# Altium schematic sheet transistor_tester_V1.07_E3.SchDoc
size A2
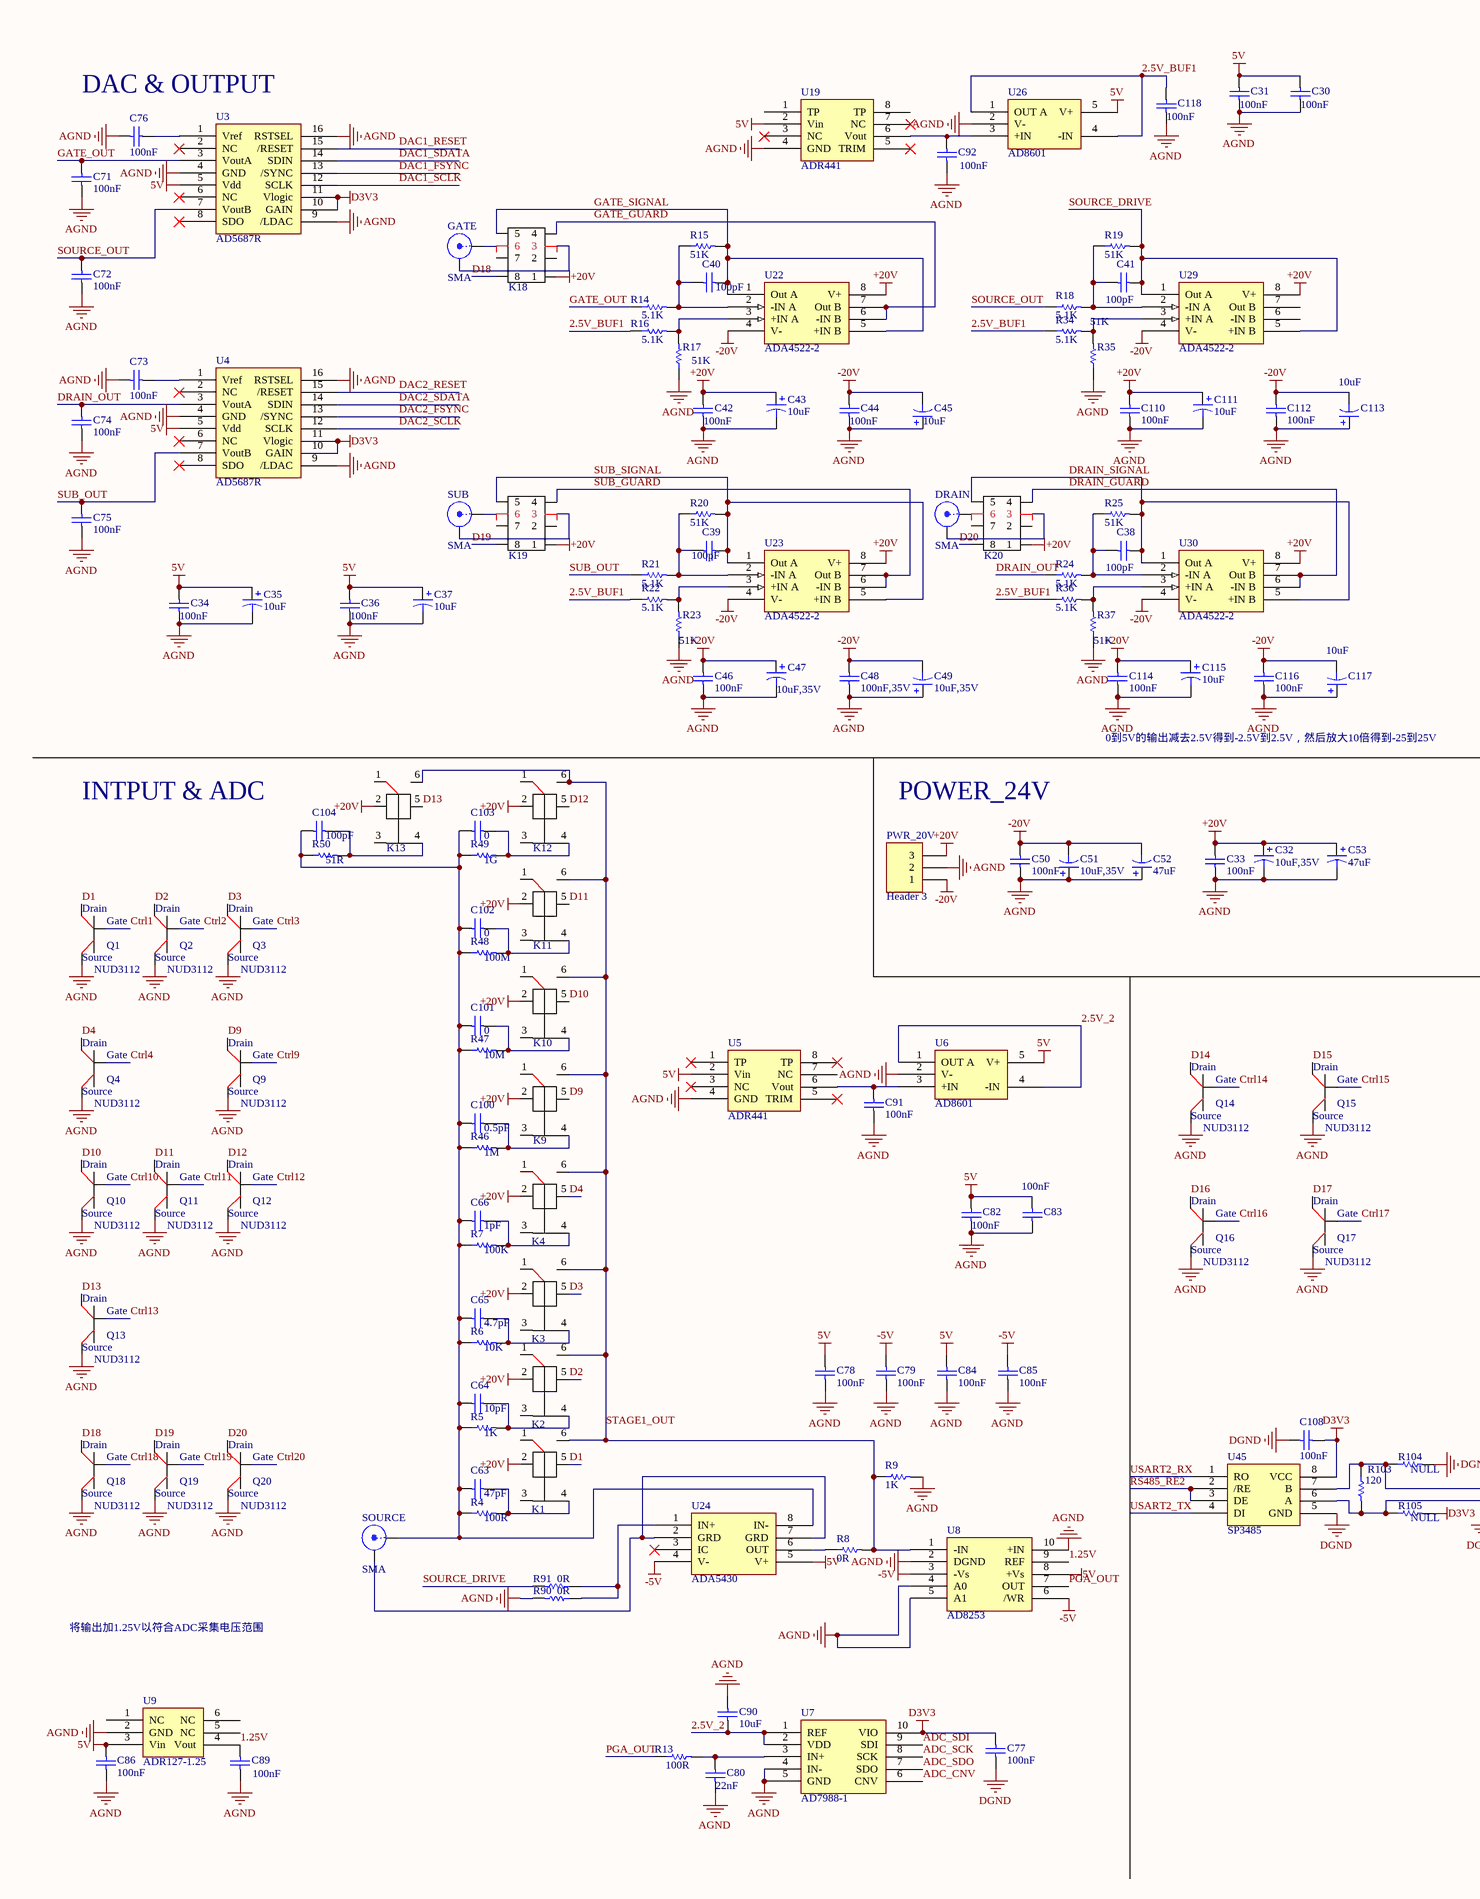
[diagram p0: transistor_tester_V1.07_E3.SchDoc, left]
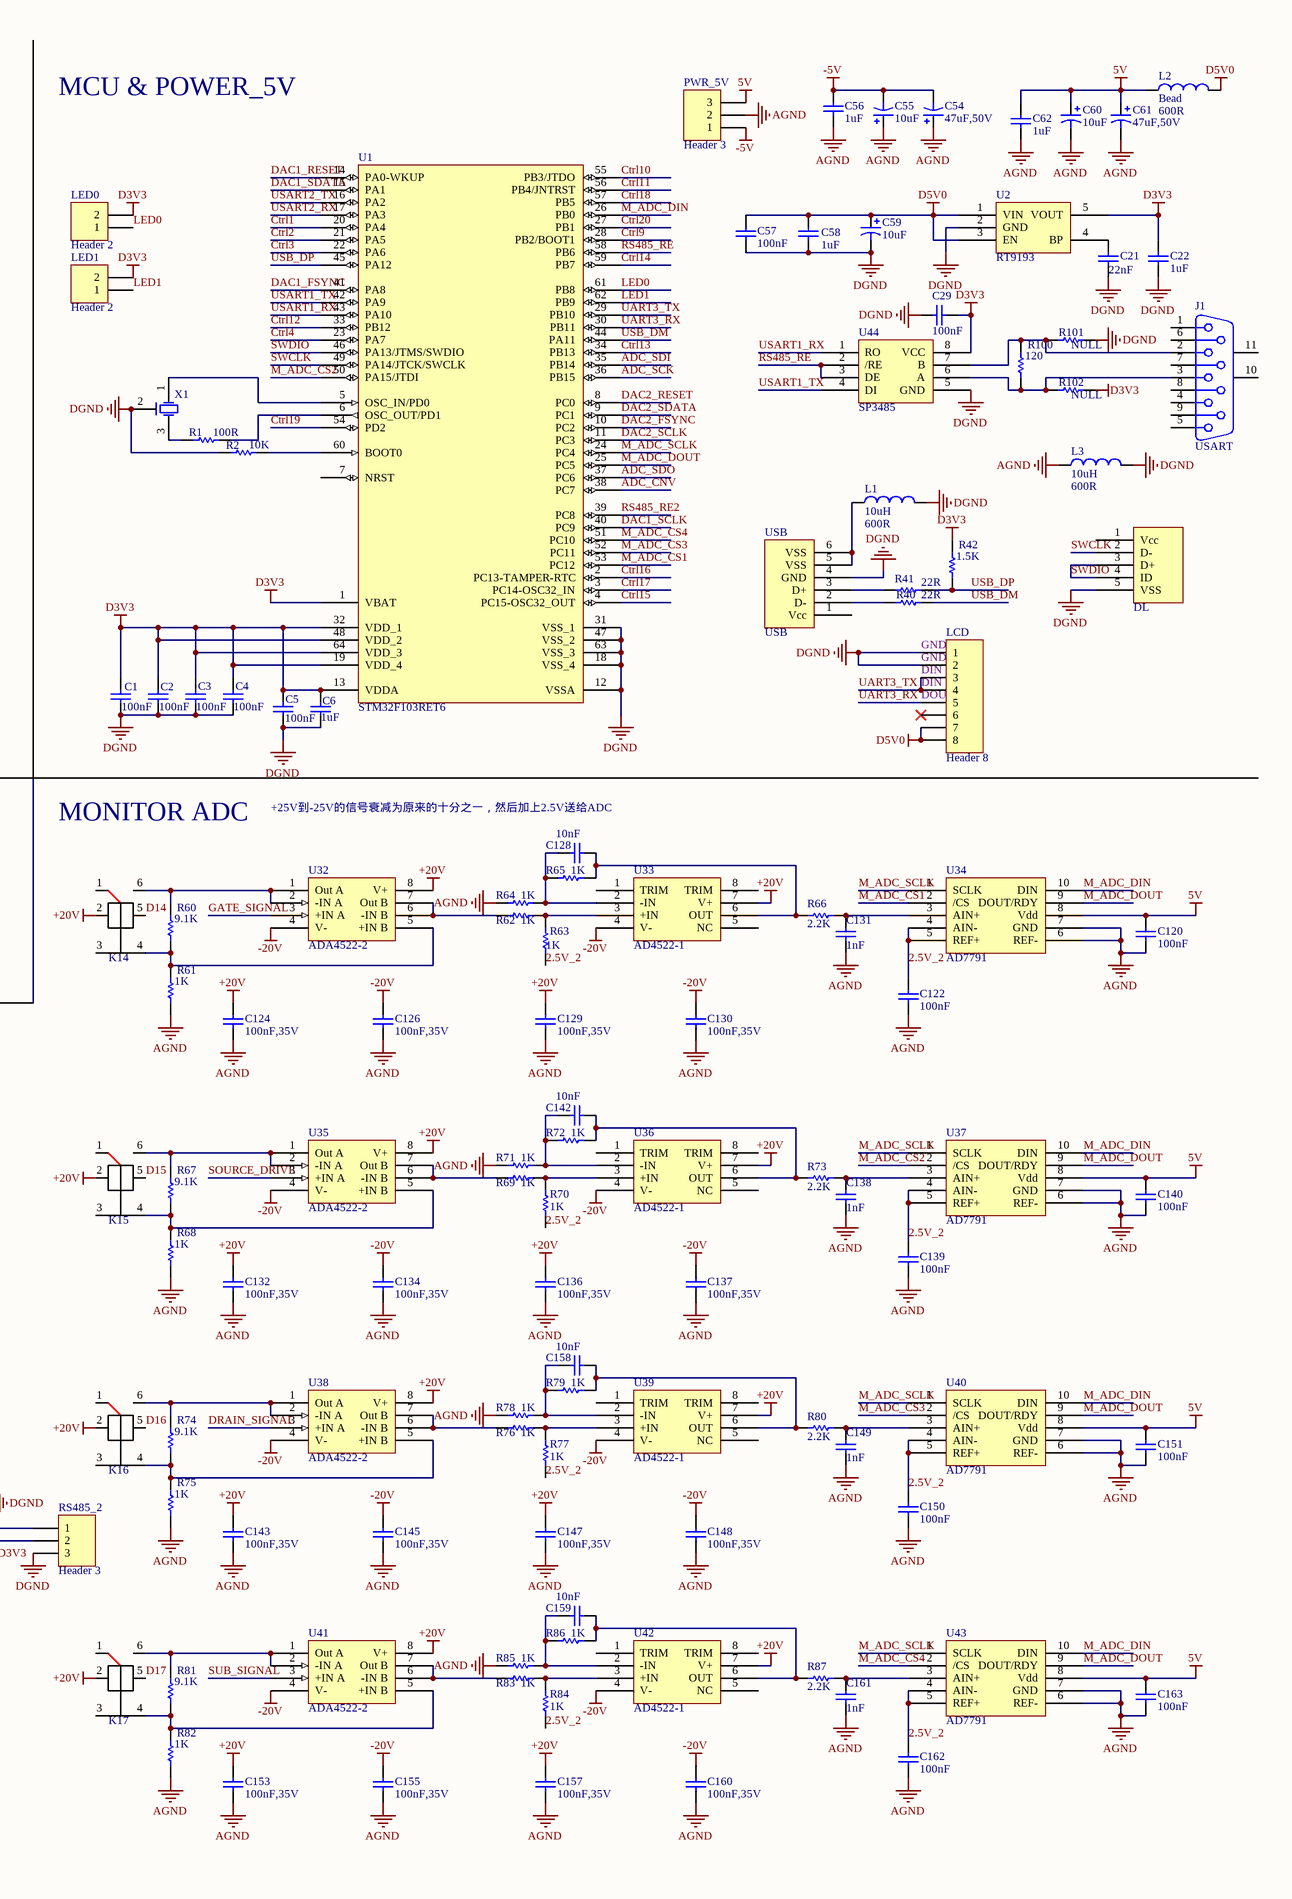
[diagram p1: transistor_tester_V1.07_E3.SchDoc, right]

## Parts
C1  100nF  [0603]
C2  100nF  [0603]
C3  100nF  [0603]
C4  100nF  [0603]
C5  100nF  [0603]
C6  1uF  [0603]
C21  22nF  [0603]
C22  1uF  [0603]
C29  100nF  [0603]
C30  100nF  [0805]
C31  100nF  [0805]
C32  value 10uF,35V  [6032_pol]  (hidden comment: 10uF)
C33  100nF  [0805]
C34  100nF  [0805]
C35  10uF  [6032_pol]
C36  100nF  [0805]
C37  10uF  [6032_pol]
C38  100pF  [0805]
C39  100pF  [0805]
C40  100pF  [0805]
C41  100pF  [0805]
C42  100nF  [0805]
C43  10uF  [6032_pol]
C44  100nF  [0805]
C45  10uF  [6032_pol]
C46  100nF  [0805]
C47  value 10uF,35V  [6032_pol]  (hidden comment: 10uF)
C48  value 100nF,35V  [0805]  (hidden comment: 100nF)
C49  value 10uF,35V  [6032_pol]  (hidden comment: 10uF)
C50  100nF  [0805]
C51  value 10uF,35V  [6032_pol]  (hidden comment: 10uF)
C52  47uF  [cap_pol_8*10.2]
C53  47uF  [cap_pol_8*10.2]
C54  47uF,50V  [cap_pol_8*10.2]
C55  10uF  [6032_pol]
C56  1uF  [0805]
C57  100nF  [0805]
C58  1uF  [0805]
C59  10uF  [6032_pol]
C60  10uF  [6032_pol]
C61  47uF,50V  [cap_pol_8*10.2]
C62  1uF  [0805]
C63  47pF  [0805]
C64  10pF  [0805]
C65  value 4.7pF  [0805]  (hidden comment: 5pF)
C66  1pF  [0805]
C71  100nF  [0603]
C72  100nF  [0603]
C73  100nF  [0603]
C74  100nF  [0603]
C75  100nF  [0603]
C76  100nF  [0603]
C77  100nF  [0805]
C78  100nF  [0603]
C79  100nF  [0603]
C80  22nF  [0603]
C82  100nF  [0603]
C83  100nF  [0805]
C84  100nF  [0805]
C85  100nF  [0805]
C86  100nF  [0603]
C89  100nF  [0603]
C90  10uF  [0805]
C91  100nF  [0805]
C92  100nF  [0805]
C100  0.5pF  [0805]
C101  value 0  [0805]  (hidden comment: NULL)
C102  value 0  [0805]  (hidden comment: NULL)
C103  value 0  [0805]  (hidden comment: NULL)
C104  100pF  [0805]
C108  100nF  [0603]
C110  100nF  [0805]
C111  10uF  [6032_pol]
C112  100nF  [0805]
C113  10uF  [6032_pol]
C114  100nF  [0805]
C115  10uF  [6032_pol]
C116  100nF  [0805]
C117  10uF  [6032_pol]
C118  100nF  [0805]
C120  100nF  [0805]
C122  100nF  [0805]
C124  value 100nF,35V  [0805]  (hidden comment: 100nF)
C126  value 100nF,35V  [0805]  (hidden comment: 100nF)
C128  10nF  [0603]
C129  value 100nF,35V  [0805]  (hidden comment: 100nF)
C130  value 100nF,35V  [0805]  (hidden comment: 100nF)
C131  1nF  [0603]
C132  value 100nF,35V  [0805]  (hidden comment: 100nF)
C134  value 100nF,35V  [0805]  (hidden comment: 100nF)
C136  value 100nF,35V  [0805]  (hidden comment: 100nF)
C137  value 100nF,35V  [0805]  (hidden comment: 100nF)
C138  1nF  [0603]
C139  100nF  [0805]
C140  100nF  [0805]
C142  10nF  [0603]
C143  value 100nF,35V  [0805]  (hidden comment: 100nF)
C145  value 100nF,35V  [0805]  (hidden comment: 100nF)
C147  value 100nF,35V  [0805]  (hidden comment: 100nF)
C148  value 100nF,35V  [0805]  (hidden comment: 100nF)
C149  1nF  [0603]
C150  100nF  [0805]
C151  100nF  [0805]
C153  value 100nF,35V  [0805]  (hidden comment: 100nF)
C155  value 100nF,35V  [0805]  (hidden comment: 100nF)
C157  value 100nF,35V  [0805]  (hidden comment: 100nF)
C158  10nF  [0603]
C159  10nF  [0603]
C160  value 100nF,35V  [0805]  (hidden comment: 100nF)
C161  1nF  [0603]
C162  100nF  [0805]
C163  100nF  [0805]
DL  USB_5pin  [USBmicro_B]  (value not drawn)
DRAIN  SMA  [SMA]
GATE  SMA  [SMA]
J1  USART  [DSUB1.385-2H9]
K1  Relay  [Relay_OMRON5V]  (value not drawn)
K2  Relay  [Relay_OMRON5V]  (value not drawn)
K3  Relay  [Relay_OMRON5V]  (value not drawn)
K4  Relay  [Relay_OMRON5V]  (value not drawn)
K9  Relay  [Relay_OMRON5V]  (value not drawn)
K10  Relay  [Relay_OMRON5V]  (value not drawn)
K11  Relay  [Relay_OMRON5V]  (value not drawn)
K12  Relay  [Relay_OMRON5V]  (value not drawn)
K13  Relay  [Relay_OMRON5V]  (value not drawn)
K14  Relay  [Relay_OMRON5V]  (value not drawn)
K15  Relay  [Relay_OMRON5V]  (value not drawn)
K16  Relay  [Relay_OMRON5V]  (value not drawn)
K17  Relay  [Relay_OMRON5V]  (value not drawn)
K18  AXICOM IM  [AXICOM_IM06]  (value not drawn)
K19  AXICOM IM  [AXICOM_IM06]  (value not drawn)
K20  AXICOM IM  [AXICOM_IM06]  (value not drawn)
L1  10uH  value 600R  [0805]
L2  Bead  value 600R  [8040]
L3  10uH  value 600R  [1206]
LCD  Header 8  [HDR1X8]
LED0  Header 2  [HDR1X2]
LED1  Header 2  [HDR1X2]
PWR_5V  Header 3  [PWR_3T]
PWR_20V  Header 3  [PWR_3T]
Q1  NUD3112  [SOT-23]
Q2  NUD3112  [SOT-23]
Q3  NUD3112  [SOT-23]
Q4  NUD3112  [SOT-23]
Q9  NUD3112  [SOT-23]
Q10  NUD3112  [SOT-23]
Q11  NUD3112  [SOT-23]
Q12  NUD3112  [SOT-23]
Q13  NUD3112  [SOT-23]
Q14  NUD3112  [SOT-23]
Q15  NUD3112  [SOT-23]
Q16  NUD3112  [SOT-23]
Q17  NUD3112  [SOT-23]
Q18  NUD3112  [SOT-23]
Q19  NUD3112  [SOT-23]
Q20  NUD3112  [SOT-23]
R1  100R  [0603]
R2  10K  [0603]
R4  value 100R  [0805]  (hidden comment: 100R_R)
R5  value 1K  [0805]  (hidden comment: 1K_R)
R6  value 10K  [0805]  (hidden comment: 10K_R)
R7  100K  [0805]
R8  0R  [0603]
R9  1K  [0603]
R13  100R  [0603]
R14  5.1K  [0805]
R15  51K  [0805]
R16  5.1K  [0805]
R17  51K  [0805]
R18  5.1K  [0805]
R19  51K  [0805]
R20  51K  [0805]
R21  5.1K  [0805]
R22  5.1K  [0805]
R23  51K  [0805]
R24  5.1K  [0805]
R25  51K  [0805]
R34  5.1K  [0805]
R35  51K  [0805]
R36  5.1K  [0805]
R37  51K  [0805]
R40  22R  [0402]
R41  22R  [0402]
R42  1.5K  [0402]
R46  1M  [0805]
R47  value 10M  [0805]  (hidden comment: 10M_R)
R48  value 100M  [0805]  (hidden comment: 100M_R)
R49  value 1G  [0805]  (hidden comment: 1G_R)
R50  value 51R  [0805]  (hidden comment: 51R_R)
R60  9.1K  [0603]
R61  1K  [0603]
R62  1K  [0603]
R63  1K  [0603]
R64  1K  [0603]
R65  1K  [0603]
R66  2.2K  [0603]
R67  9.1K  [0603]
R68  1K  [0603]
R69  1K  [0603]
R70  1K  [0603]
R71  1K  [0603]
R72  1K  [0603]
R73  2.2K  [0603]
R74  9.1K  [0603]
R75  1K  [0603]
R76  1K  [0603]
R77  1K  [0603]
R78  1K  [0603]
R79  1K  [0603]
R80  2.2K  [0603]
R81  9.1K  [0603]
R82  1K  [0603]
R83  1K  [0603]
R84  1K  [0603]
R85  1K  [0603]
R86  1K  [0603]
R87  2.2K  [0603]
R90  0R  [0603]
R91  value 0R  [0603]  (hidden comment: Res1)
R100  120  [0603]
R101  NULL  [0603]
R102  NULL  [0603]
R103  120  [0603]
R104  NULL  [0603]
R105  NULL  [0603]
RS485_2  Header 3  [HDR1X3]
SOURCE  SMA  [SMA]
SUB  SMA  [SMA]
U1  STM32F103RET6  [LQFP64_N]
U2  RT9193  [SOT-23-5]
U3  AD5687R  [TSSOP16]
U4  AD5687R  [TSSOP16]
U5  ADR441  [SO-8N]
U6  AD8601  [SOT-23-5]
U7  AD7988-1  [MSOP10]
U8  AD8253  [RM-10]
U9  ADR127-1.25  [SOT_UJ6]
U19  ADR441  [SO-8N]
U22  ADA4522-2  [SO-8N]
U23  ADA4522-2  [SO-8N]
U24  ADA5430  [SO-8N]
U26  AD8601  [SOT-23-5]
U29  ADA4522-2  [SO-8N]
U30  ADA4522-2  [SO-8N]
U32  ADA4522-2  [SO-8N]
U33  AD4522-1  [SO-8N]
U34  AD7791  [RM-10]
U35  ADA4522-2  [SO-8N]
U36  AD4522-1  [SO-8N]
U37  AD7791  [RM-10]
U38  ADA4522-2  [SO-8N]
U39  AD4522-1  [SO-8N]
U40  AD7791  [RM-10]
U41  ADA4522-2  [SO-8N]
U42  AD4522-1  [SO-8N]
U43  AD7791  [RM-10]
U44  SP3485  [SO-8N]
U45  SP3485  [SO-8N]
USB  USB  [USB_A]
X1  8M smd  [8Mhz_XTAL]  (value not drawn)

## Nets
5V: C30.2 C31.2 C34.2 C35.1 C36.2 C37.1 C60.1 C61.1 C62.2 C78.2 C82.2 C83.2 C84.2 C86.2 C120.2 C140.2 C151.2 C163.2 L2.1 PWR_5V.3 U3.5(Vdd) U4.5(Vdd) U5.2(Vin) U6.5(V+) U8.8(+Vs) U9.3(Vin) U19.2(Vin) U24.5(V+) U26.5(V+) U34.8(Vdd) U37.8(Vdd) U40.8(Vdd) U43.8(Vdd)
+20V: C32.1 C33.1 C42.2 C43.1 C46.2 C47.1 C53.1 C110.2 C111.1 C114.2 C115.1 C124.2 C129.2 C132.2 C136.2 C143.2 C147.2 C153.2 C157.2 K1.2 K2.2 K3.2 K4.2 K9.2 K10.2 K11.2 K12.2 K13.2 K14.2 K15.2 K16.2 K17.2 K18.1 K19.1 K20.1 PWR_20V.3 U22.8(V+) U23.8(V+) U29.8(V+) U30.8(V+) U32.8(V+) U33.7(V+) U35.8(V+) U36.7(V+) U38.8(V+) U39.7(V+) U41.8(V+) U42.7(V+)
-5V: C54.2 C55.2 C56.2 C79.2 C85.2 PWR_5V.1 U8.3(-Vs) U8.6(/WR) U24.4(V-)
-20V: C44.2 C45.2 C48.2 C49.2 C50.1 C51.2 C52.2 C112.2 C113.2 C116.2 C117.2 C126.2 C130.2 C134.2 C137.2 C145.2 C148.2 C155.2 C160.2 PWR_20V.1 U22.4(V-) U23.4(V-) U29.4(V-) U30.4(V-) U32.4(V-) U33.4(V-) U35.4(V-) U36.4(V-) U38.4(V-) U39.4(V-) U41.4(V-) U42.4(V-)
AGND: C30.1 C31.1 C32.2 C33.2 C34.1 C35.2 C36.1 C37.2 C42.1 C43.2 C44.1 C45.1 C46.1 C47.2 C48.1 C49.1 C50.2 C51.1 C52.1 C53.2 C54.1 C55.1 C56.1 C60.2 C61.2 C62.1 C71.2 C72.2 C73.2 C74.2 C75.2 C76.2 C78.1 C79.1 C80.2 C82.1 C83.1 C84.1 C85.1 C86.1 C89.1 C90.2 C91.1 C92.1 C110.1 C111.2 C112.1 C113.1 C114.1 C115.2 C116.1 C117.1 C118.1 C120.1 C122.1 C124.1 C126.1 C129.1 C130.1 C131.1 C132.1 C134.1 C136.1 C137.1 C138.1 C139.1 C140.1 C143.1 C145.1 C147.1 C148.1 C149.1 C150.1 C151.1 C153.1 C155.1 C157.1 C160.1 C161.1 C162.1 C163.1 L3.1 PWR_5V.2 PWR_20V.2 Q1.2(Source) Q2.2(Source) Q3.2(Source) Q4.2(Source) Q9.2(Source) Q10.2(Source) Q11.2(Source) Q12.2(Source) Q13.2(Source) Q14.2(Source) Q15.2(Source) Q16.2(Source) Q17.2(Source) Q18.2(Source) Q19.2(Source) Q20.2(Source) R9.2 R17.1 R23.1 R35.1 R37.1 R61.2 R64.2 R68.2 R71.2 R75.2 R78.2 R82.2 R85.2 R90.2 U3.4(GND) U3.9(/LDAC) U3.16(RSTSEL) U4.4(GND) U4.9(/LDAC) U4.16(RSTSEL) U5.4(GND) U6.2(V-) U7.4(IN-) U7.5(GND) U8.2(DGND) U8.4(A0) U8.5(A1) U8.10(+IN) U9.2(GND) U19.4(GND) U26.2(V-) U34.6(REF-) U34.7(GND) U37.6(REF-) U37.7(GND) U40.6(REF-) U40.7(GND) U43.6(REF-) U43.7(GND)
D3V3: C1.2 C2.2 C3.2 C4.2 C5.2 C6.2 C22.2 C29.2 C77.2 C108.2 LED0.2 LED1.2 R42.1 R102.2 R105.2 U1.1(VBAT) U1.13(VDDA) U1.19(VDD_4) U1.32(VDD_1) U1.48(VDD_2) U1.64(VDD_3) U2.5(VOUT) U3.10(GAIN) U3.11(Vlogic) U4.10(GAIN) U4.11(Vlogic) U7.10(VIO) U44.8(VCC) U45.8(VCC)
D5V0: C57.2 C58.2 C59.1 L2.2 LCD.7 LCD.8 U2.1(VIN) U2.3(EN)
DGND: C1.1 C2.1 C3.1 C4.1 C5.1 C6.1 C21.1 C22.1 C29.1 C57.1 C58.1 C59.2 C77.1 C108.1 DL.5(VSS) L1.2 L3.2 LCD.1 LCD.2 R2.2 R101.2 R104.2 RS485_2.3 U1.12(VSSA) U1.18(VSS_4) U1.31(VSS_1) U1.47(VSS_2) U1.63(VSS_3) U2.2(GND) U44.5(GND) U45.5(GND) USB.4(GND) X1.2(GND)
1.25V: C89.2 U8.9(REF) U9.4(Vout)
2.5V_2: C90.1 C122.2 C139.2 C150.2 C162.2 R63.1 R70.1 R77.1 R84.1 U6.1(OUT_A) U6.4(-IN) U7.1(REF) U7.2(VDD) U34.4(AIN-) U34.5(REF+) U37.4(AIN-) U37.5(REF+) U40.4(AIN-) U40.5(REF+) U43.4(AIN-) U43.5(REF+)
2.5V_BUF1: C118.2 R16.1 R22.1 R34.1 R36.1 U26.1(OUT_A) U26.4(-IN)
ADC_CNV: U1.38(PC7) U7.6(CNV)
ADC_SCK: U1.36(PB15) U7.8(SCK)
ADC_SDI: U1.35(PB14) U7.9(SDI)
ADC_SDO: U1.37(PC6) U7.7(SDO)
Ctrl1: Q1.1(Gate) U1.20(PA4)
Ctrl2: Q2.1(Gate) U1.21(PA5)
Ctrl3: Q3.1(Gate) U1.22(PA6)
Ctrl4: Q4.1(Gate) U1.23(PA7)
Ctrl9: Q9.1(Gate) U1.28(PB2/BOOT1)
Ctrl10: Q10.1(Gate) U1.55(PB3/JTDO)
Ctrl11: Q11.1(Gate) U1.56(PB4/JNTRST)
Ctrl12: Q12.1(Gate) U1.33(PB12)
Ctrl13: Q13.1(Gate) U1.34(PB13)
Ctrl14: Q14.1(Gate) U1.59(PB7)
Ctrl15: Q15.1(Gate) U1.4(PC15-OSC32_OUT)
Ctrl16: Q16.1(Gate) U1.2(PC13-TAMPER-RTC)
Ctrl17: Q17.1(Gate) U1.3(PC14-OSC32_IN)
Ctrl18: Q18.1(Gate) U1.57(PB5)
Ctrl19: Q19.1(Gate) U1.54(PD2)
Ctrl20: Q20.1(Gate) U1.27(PB1)
D1: K1.5 Q1.3(Drain)
D2: K2.5 Q2.3(Drain)
D3: K3.5 Q3.3(Drain)
D4: K4.5 Q4.3(Drain)
D9: K9.5 Q9.3(Drain)
D10: K10.5 Q10.3(Drain)
D11: K11.5 Q11.3(Drain)
D12: K12.5 Q12.3(Drain)
D13: K13.5 Q13.3(Drain)
D14: K14.5 Q14.3(Drain)
D15: K15.5 Q15.3(Drain)
D16: K16.5 Q16.3(Drain)
D17: K17.5 Q17.3(Drain)
D18: K18.8 Q18.3(Drain)
D19: K19.8 Q19.3(Drain)
D20: K20.8 Q20.3(Drain)
DAC1_FSYNC: U1.41(PA8) U3.13(/SYNC)
DAC1_RESET: U1.14(PA0-WKUP) U3.15(/RESET)
DAC1_SCLK: U1.40(PC9) U3.12(SCLK)
DAC1_SDATA: U1.15(PA1) U3.14(SDIN)
DAC2_FSYNC: U1.10(PC2) U4.13(/SYNC)
DAC2_RESET: U1.8(PC0) U4.15(/RESET)
DAC2_SCLK: U1.11(PC3) U4.12(SCLK)
DAC2_SDATA: U1.9(PC1) U4.14(SDIN)
DRAIN_GUARD: K20.4 U30.6(-IN_B) U30.7(Out_B)
DRAIN_OUT: C74.1 R24.1 U4.3(VoutA)
DRAIN_SIGNAL: C38.2 K20.5 R25.2 U30.1(Out_A) U30.5(+IN_B) U38.3(+IN_A)
GATE_GUARD: K18.4 U22.6(-IN_B) U22.7(Out_B)
GATE_OUT: C71.1 R14.1 U3.3(VoutA)
GATE_SIGNAL: C40.2 K18.5 R15.2 U22.1(Out_A) U22.5(+IN_B) U32.3(+IN_A)
LED0: LED0.1 U1.61(PB8)
LED1: LED1.1 U1.62(PB9)
M_ADC_CS1: U1.53(PC12) U34.2(/CS)
M_ADC_CS2: U1.50(PA15/JTDI) U37.2(/CS)
M_ADC_CS3: U1.52(PC11) U40.2(/CS)
M_ADC_CS4: U1.51(PC10) U43.2(/CS)
M_ADC_DIN: U1.26(PB0) U34.10(DIN) U37.10(DIN) U40.10(DIN) U43.10(DIN)
M_ADC_DOUT: U1.25(PC5) U34.9(DOUT/RDY) U37.9(DOUT/RDY) U40.9(DOUT/RDY) U43.9(DOUT/RDY)
M_ADC_SCLK: U1.24(PC4) U34.1(SCLK) U37.1(SCLK) U40.1(SCLK) U43.1(SCLK)
PGA_OUT: R13.1 U8.7(OUT)
RS485_RE: U1.58(PB6) U44.2(/RE) U44.3(DE)
RS485_RE2: U1.39(PC8) U45.2(/RE) U45.3(DE)
SOURCE_DRIVE: C41.1 R19.2 R91.2 U29.1(Out_A) U29.5(+IN_B) U35.3(+IN_A)
SOURCE_OUT: C72.1 R18.1 U3.7(VoutB)
STAGE1_OUT: K1.6 K2.6 K3.6 K4.6 K9.6 K10.6 K11.6 K12.6 K13.6 R8.2 R9.1 U8.1(-IN)
SUB_GUARD: K19.4 U23.6(-IN_B) U23.7(Out_B)
SUB_OUT: C75.1 R21.1 U4.7(VoutB)
SUB_SIGNAL: C39.2 K19.5 R20.2 U23.1(Out_A) U23.5(+IN_B) U41.3(+IN_A)
SWCLK: DL.2(D-) U1.49(PA14/JTCK/SWCLK)
SWDIO: DL.3(D+) DL.4(ID) U1.46(PA13/JTMS/SWDIO)
UART3_RX: LCD.5 U1.30(PB11)
UART3_TX: LCD.3 LCD.4 U1.29(PB10)
USART1_RX: U1.43(PA10) U44.1(RO)
USART1_TX: U1.42(PA9) U44.4(DI)
USART2_RX: U1.17(PA3) U45.1(RO)
USART2_TX: U1.16(PA2) U45.4(DI)
USB_DM: R40.2 U1.44(PA11)
USB_DP: R41.2 R42.2 U1.45(PA12)
NetC21_2: C21.2 U2.4(BP)
NetC38_1: C38.1 R24.2 R25.1 U30.2(-IN_A)
NetC39_1: C39.1 R20.1 R21.2 U23.2(-IN_A)
NetC40_1: C40.1 R14.2 R15.1 U22.2(-IN_A)
NetC41_2: C41.2 R18.2 R19.1 U29.2(-IN_A)
NetC63_1: C63.1 K1.4 R4.2
NetC63_2: C63.2 C64.2 C65.2 C66.2 C100.2 C101.2 C102.2 C103.2 C104.2 R4.1 R5.1 R6.1 R7.1 R46.1 R47.1 R48.1 R49.1 R50.1 SOURCE.1(X) U24.8(IN-)
NetC64_1: C64.1 K2.4 R5.2
NetC65_1: C65.1 K3.4 R6.2
NetC66_1: C66.1 K4.4 R7.2
NetC73_1: C73.1 U4.1(Vref)
NetC76_1: C76.1 U3.1(Vref)
NetC80_1: C80.1 R13.2 U7.3(IN+)
NetC91_2: C91.2 U5.6(Vout) U6.3(+IN)
NetC92_2: C92.2 U19.6(Vout) U26.3(+IN)
NetC100_1: C100.1 K9.4 R46.2
NetC101_1: C101.1 K10.4 R47.2
NetC102_1: C102.1 K11.4 R48.2
NetC103_1: C103.1 K12.4 R49.2
NetC104_1: C104.1 K13.4 R50.2
NetC128_1: C128.1 R65.1 R66.2 U33.6(OUT)
NetC128_2: C128.2 R64.1 R65.2 U33.2(-IN)
NetC131_2: C131.2 R66.1 U34.3(AIN+)
NetC138_2: C138.2 R73.1 U37.3(AIN+)
NetC142_1: C142.1 R72.1 R73.2 U36.6(OUT)
NetC142_2: C142.2 R71.1 R72.2 U36.2(-IN)
NetC149_2: C149.2 R80.1 U40.3(AIN+)
NetC158_1: C158.1 R79.1 R80.2 U39.6(OUT)
NetC158_2: C158.2 R78.1 R79.2 U39.2(-IN)
NetC159_1: C159.1 R86.1 R87.2 U42.6(OUT)
NetC159_2: C159.2 R85.1 R86.2 U42.2(-IN)
NetC161_2: C161.2 R87.1 U43.3(AIN+)
NetDRAIN_1: DRAIN.1(X) K20.6
NetDRAIN_2: DRAIN.2(Y) K20.3
NetGATE_1: GATE.1(X) K18.6
NetGATE_2: GATE.2(Y) K18.3
NetJ1_2: J1.2 R100.1 R101.1 U44.7(B)
NetJ1_3: J1.3 R100.2 R102.1 U44.6(A)
NetK14_4: K14.4 R60.2 R61.1 U32.5(+IN_B)
NetK14_6: K14.6 R60.1 U32.1(Out_A) U32.2(-IN_A)
NetK15_4: K15.4 R67.2 R68.1 U35.5(+IN_B)
NetK15_6: K15.6 R67.1 U35.1(Out_A) U35.2(-IN_A)
NetK16_4: K16.4 R74.2 R75.1 U38.5(+IN_B)
NetK16_6: K16.6 R74.1 U38.1(Out_A) U38.2(-IN_A)
NetK17_4: K17.4 R81.2 R82.1 U41.5(+IN_B)
NetK17_6: K17.6 R81.1 U41.1(Out_A) U41.2(-IN_A)
NetK19_3: K19.3 SUB.2(Y)
NetK19_6: K19.6 SUB.1(X)
NetL1_1: L1.1 USB.5(VSS) USB.6(VSS)
NetR1_1: R1.1 X1.3(OSC2)
NetR1_2: R1.2 U1.6(OSC_OUT/PD1)
NetR2_1: R2.1 U1.60(BOOT0)
NetR8_1: R8.1 U24.6(OUT)
NetR16_2: R16.2 R17.2 U22.3(+IN_A)
NetR22_2: R22.2 R23.2 U23.3(+IN_A)
NetR34_2: R34.2 R35.2 U29.3(+IN_A)
NetR36_2: R36.2 R37.2 U30.3(+IN_A)
NetR40_1: R40.1 USB.2(D-)
NetR41_1: R41.1 USB.3(D+)
NetR62_1: R62.1 U32.6(-IN_B) U32.7(Out_B)
NetR62_2: R62.2 R63.2 U33.3(+IN)
NetR69_1: R69.1 U35.6(-IN_B) U35.7(Out_B)
NetR69_2: R69.2 R70.2 U36.3(+IN)
NetR76_1: R76.1 U38.6(-IN_B) U38.7(Out_B)
NetR76_2: R76.2 R77.2 U39.3(+IN)
NetR83_1: R83.1 U41.6(-IN_B) U41.7(Out_B)
NetR83_2: R83.2 R84.2 U42.3(+IN)
NetR90_1: R90.1 R91.1 U24.1(IN+)
NetR103_1: R103.1 R104.1 RS485_2.1 U45.7(B)
NetR103_2: R103.2 R105.1 RS485_2.2 U45.6(A)
NetSOURCE_2: SOURCE.2(Y) U24.2(GRD) U24.7(GRD)
NetU1_5: U1.5(OSC_IN/PD0) X1.1(OSC1)

Not connected (* = marked no-connect by the designer): DL 1(Vcc); J1 1 4 5 6 7 8 9 10(MH1) 11(MH2); K1 1 3; K2 1 3; K3 1 3; K4 1 3; K9 1 3; K10 1 3; K11 1 3; K12 1 3; K13 1 3; K14 1 3; K15 1 3; K16 1 3; K17 1 3; K18 2 7; K19 2 7; K20 2 7; LCD 6*; U1 7(NRST); U3 2(NC)* 6(NC)* 8(SDO)*; U4 2(NC)* 6(NC)* 8(SDO)*; U5 1(TP)* 3(NC)* 5(TRIM)* 7(NC) 8(TP)*; U9 1(NC) 5(NC) 6(NC); U19 1(TP) 3(NC)* 5(TRIM)* 7(NC)* 8(TP); U24 3(IC)*; U29 6(-IN_B) 7(Out_B); U33 1(TRIM) 5(NC) 8(TRIM); U36 1(TRIM) 5(NC) 8(TRIM); U39 1(TRIM) 5(NC) 8(TRIM); U42 1(TRIM) 5(NC) 8(TRIM); USB 1(Vcc)

## Notes on the sheet
- DAC & OUTPUT
- MCU & POWER_5V
- (near LCD) DIN
- (near LCD) GND
- (near LCD) DOUT
- 0到5V的输出减去2.5V得到-2.5V到2.5V，然后放大10倍得到-25到25V
- INTPUT & ADC
- POWER_24V
- MONITOR ADC
- +25V到-25V的信号衰减为原来的十分之一，然后加上2.5V送给ADC
- 将输出加1.25V以符合ADC采集电压范围

## Library data of the parts
C1-C6 C29 C108 = Cap: Capacitor; Value: 100pF; Published: 8-Jun-2000; LatestRevisionDate: 17-Jul-2002; LatestRevisionNote: Re-released for DXP Platform.; PackageReference: RAD-0.3; Publisher: Altium Limited; PackageDescription: Radial Cap, Thru-Hole; 2 Leads; 0.3 in Pin Spacing
C21 C22 C30 C31 C33 C38-C41 C46 C48 C50 C58 C63-C66 C71-C76 C78-C80 C82-C86 C89-C92 C100-C104 C110 C112 C114 C116 C118 C124 C126 C128-C130 C132 C134 C136 C137 C142 C143 C145 C147 C148 C153 C155 C157-C160 = Cap: Capacitor; Published: 8-Jun-2000; LatestRevisionDate: 17-Jul-2002; LatestRevisionNote: Re-released for DXP Platform.; PackageReference: RAD-0.3; Publisher: Altium Limited; PackageDescription: Radial Cap, Thru-Hole; 2 Leads; 0.3 in Pin Spacing
  C21 C80: Value: 22nF
  C22 C58: Value: 1uF
  C30 C31 C33 C46 C50 C71-C76 C78 C79 C82-C86 C89 C91 C92 C110 C112 C114 C116 C118: Value: 100nF
  C38-C41 C104: Value: 100pF
  C63: Value: 47pF
  C64: Value: 10pF
  C66: Value: 1pF
  C90: Value: 10uF
  C100: Value: 0.5pF
  C128 C142 C158 C159: Value: 10nF
C32 C47 C49 C51 C111 C113 C115 C117 = Cap Pol1: Polarized Capacitor (Radial); Published: 8-Jun-2000; LatestRevisionDate: 17-Jul-2002; LatestRevisionNote: Re-released for DXP Platform.; PackageReference: RB7.6-15; Publisher: Altium Limited; PackageDescription: Polarized Capacitor (Radial); 2 Leads
  C111 C113 C115 C117: Value: 10uF
C34 C36 C42 C44 = Cap: Capacitor; Value: 100nF,35V; Published: 8-Jun-2000; LatestRevisionDate: 17-Jul-2002; LatestRevisionNote: Re-released for DXP Platform.; PackageReference: RAD-0.3; Publisher: Altium Limited; PackageDescription: Radial Cap, Thru-Hole; 2 Leads; 0.3 in Pin Spacing
C35 C37 C43 C45 = Cap Pol1: Polarized Capacitor (Radial); Value: 10uF,35V; Published: 8-Jun-2000; LatestRevisionDate: 17-Jul-2002; LatestRevisionNote: Re-released for DXP Platform.; PackageReference: RB7.6-15; Publisher: Altium Limited; PackageDescription: Polarized Capacitor (Radial); 2 Leads
C52-C55 C59-C61 = Cap Pol1: Polarized Capacitor (Radial); Value: 100pF; Published: 8-Jun-2000; LatestRevisionDate: 17-Jul-2002; LatestRevisionNote: Re-released for DXP Platform.; PackageReference: RB7.6-15; Publisher: Altium Limited; PackageDescription: Polarized Capacitor (Radial); 2 Leads
C56 C62 C77 C120 C122 C131 C138-C140 C149-C151 C161-C163 = Cap: Capacitor,100V; Value: 100pF; Published: 8-Jun-2000; LatestRevisionDate: 17-Jul-2002; LatestRevisionNote: Re-released for DXP Platform.; PackageReference: RAD-0.3; Publisher: Altium Limited; PackageDescription: Radial Cap, Thru-Hole; 2 Leads; 0.3 in Pin Spacing
C57 = Cap: Capacitor,100V; Published: 8-Jun-2000; LatestRevisionDate: 17-Jul-2002; LatestRevisionNote: Re-released for DXP Platform.; PackageReference: RAD-0.3; Publisher: Altium Limited; PackageDescription: Radial Cap, Thru-Hole; 2 Leads; 0.3 in Pin Spacing; Value: 100nF
DRAIN GATE SOURCE SUB = BNC: BNC Elbow Connector; LatestRevisionDate: 17-Jul-2002; LatestRevisionNote: Re-released for DXP Platform.; Publisher: Altium Limited
J1 = D Connector 9: Receptacle Assembly, 9 Position, Right Angle; PackageDocument: O; Positions: 9; Published: 15-Jun-2001; LatestRevisionDate: 17-Jul-2002; LatestRevisionNote: Re-released for DXP Platform.; DatasheetDocument: 1-Sep-1999; PackageReference: 788750; Publisher: Altium Limited; Orientation: Right Angle; Gender: Receptacle
K1-K4 K9-K17 = Relay_OMRON5V: Relay OMRON
K18-K20 = AXiCOM IM05
L1-L3 = Inductor: Code_IEC: 1005; Published: 8-Jun-2000; LatestRevisionDate: 29-May-2009; LatestRevisionNote: IPC-7351 Footprint Added.; PackageReference: 0402-A; Publisher: Altium Limited; PackageDescription: Chip Inductor; Code_JEITA: 0402
LCD = Header 8: Header, 8-Pin; LatestRevisionDate: 17-Jul-2002; LatestRevisionNote: Re-released for DXP Platform.; Publisher: Altium Limited
LED0 LED1 = Header 2: Header, 2-Pin; LatestRevisionDate: 17-Jul-2002; LatestRevisionNote: Re-released for DXP Platform.; Publisher: Altium Limited
PWR_5V PWR_20V RS485_2 = Header 3: Header, 3-Pin; LatestRevisionDate: 17-Jul-2002; LatestRevisionNote: Re-released for DXP Platform.; Publisher: Altium Limited
Q1-Q4 Q9-Q20 = NUD3105: Relay Driver 5V Supply; manufactor: On Semiconductor
R1 = Res1: Resistor; Value: 1K; Published: 8-Jun-2000; LatestRevisionDate: 17-Jul-2002; LatestRevisionNote: Re-released for DXP Platform.; PackageReference: AXIAL-0.3; Publisher: Altium Limited; PackageDescription: Axial Device, Thru-Hole; 2 Leads; 0.3 in Pin Spacing
R2 R4-R8 R13-R25 R34-R37 R40-R42 R46-R50 R60-R87 R90 R91 R100-R105 = Res1: Resistor; Published: 8-Jun-2000; LatestRevisionDate: 17-Jul-2002; LatestRevisionNote: Re-released for DXP Platform.; PackageReference: AXIAL-0.3; Publisher: Altium Limited
  R2: Value: 10K
  R4-R6 R47-R50 R91: PackageDescription: Axial Device, Thru-Hole; 2 Leads; 0.3 in Pin Spacing
  R7: PackageDescription: Axial Device, Thru-Hole; 2 Leads; 0.3 in Pin Spacing; Value: 100K
  R8 R90: PackageDescription: Axial Device, Thru-Hole; 2 Leads; 0.3 in Pin Spacing; Value: 0R
  R13: PackageDescription: Axial Device, Thru-Hole; 2 Leads; 0.3 in Pin Spacing; Value: 100R
  R14 R16 R18 R21 R22 R24 R34 R36: PackageDescription: Axial Device, Thru-Hole; 2 Leads; 0.3 in Pin Spacing; Value: 5.1K
  R15 R17 R19 R20 R23 R25 R35 R37: PackageDescription: Axial Device, Thru-Hole; 2 Leads; 0.3 in Pin Spacing; Value: 51K
  R46: PackageDescription: Axial Device, Thru-Hole; 2 Leads; 0.3 in Pin Spacing; Value: 1M
  R62-R65 R69-R72 R76-R79 R83-R86: PackageDescription: Axial Device, Thru-Hole; 2 Leads; 0.3 in Pin Spacing; Value: 1K
  R66 R73 R80 R87: PackageDescription: Axial Device, Thru-Hole; 2 Leads; 0.3 in Pin Spacing; Value: 2.2K
R9 = Res1: Resistor; Value: 0R; Published: 8-Jun-2000; LatestRevisionDate: 17-Jul-2002; LatestRevisionNote: Re-released for DXP Platform.; PackageReference: AXIAL-0.3; Publisher: Altium Limited; PackageDescription: Axial Device, Thru-Hole; 2 Leads; 0.3 in Pin Spacing
U1 = STM32F103RBT6: STM32 ARM-based 32-bit MCU with 128 Kbytes Flash, 64-pin LQFP, Industrial Temperature; Published: 30-May-2008; DatasheetVersion: rev6, Mar-2008; PackageVersion: Mar-2008; PackageReference: LQFP64; Publisher: Altium Limited; PackageDescription: 64-Pin Low-Profile Quad Flat Pack, 10 x 10 mm Body, 0.5 mm Pitch (LQFP64); ComponentLink1Description: Manufacturer Link; ComponentLink1URL: www.st.com/stm32; ComponentLink2Description: Datasheet; ComponentLink2URL: http://www.st.com/stonline/products/literature/ds/13587.pdf
U3 U4 = AD5687R: manufacture: ADI, inc
U5 U19 = ADR441: Ultralow Noise, XFET Voltage References
U6 U26 = AD8601: Precision CMOS, Single Supply, Rail to Rail, Windband Operational Amplifiers
U8 = AD8253: Manufacture: ADI
U9 = ADR127
U22 U23 U29 U30 U32 U35 U38 U41 = AD8676
U33 U36 U39 U42 = OP27
U34 U37 U40 U43 = AD7791: One channel 24 bits ADC
USB = USB_Normal: USB interface